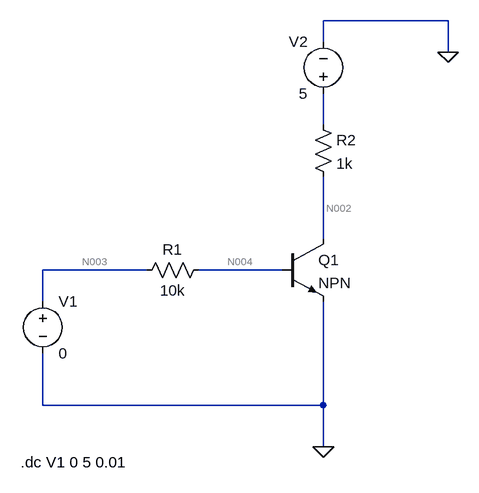
[diagram p0: schematic 1_Zadatak_Lab6.asc]
1_Zadatak_Lab6.asc, the LTspice schematic file:
Version 4
SHEET 1 880 680
WIRE 704 -304 512 -304
WIRE 512 -272 512 -304
WIRE 704 -256 704 -304
WIRE 512 -144 512 -192
WIRE 512 32 512 -64
WIRE 240 80 80 80
WIRE 448 80 320 80
WIRE 80 128 80 80
WIRE 80 288 80 208
WIRE 512 288 512 128
WIRE 512 288 80 288
WIRE 512 352 512 288
FLAG 704 -256 0
FLAG 512 352 0
SYMBOL voltage 80 112 R0
SYMATTR InstName V1
SYMATTR Value 0
SYMBOL res 336 64 R90
WINDOW 0 0 56 VBottom 2
WINDOW 3 32 56 VTop 2
SYMATTR InstName R1
SYMATTR Value 10k
SYMBOL npn 448 32 R0
SYMATTR InstName Q1
SYMBOL res 496 -160 R0
SYMATTR InstName R2
SYMATTR Value 1k
SYMBOL voltage 512 -176 R180
WINDOW 0 24 96 Left 2
WINDOW 3 24 16 Left 2
SYMATTR InstName V2
SYMATTR Value 5
TEXT 46 376 Left 2 !.dc V1 0 5 0.01

The netlist it stands for:
* 1_Zadatak_Lab6.asc
V1 N003 0 0
R1 N004 N003 10k
Q1 N002 N004 0 0 NPN
R2 N001 N002 1k
V2 N001 0 5
.model NPN NPN
.model PNP PNP
.lib standard.bjt
.dc V1 0 5 0.01
.backanno
.end

* Results of the author's LTspice run, read from the files saved beside the schematic
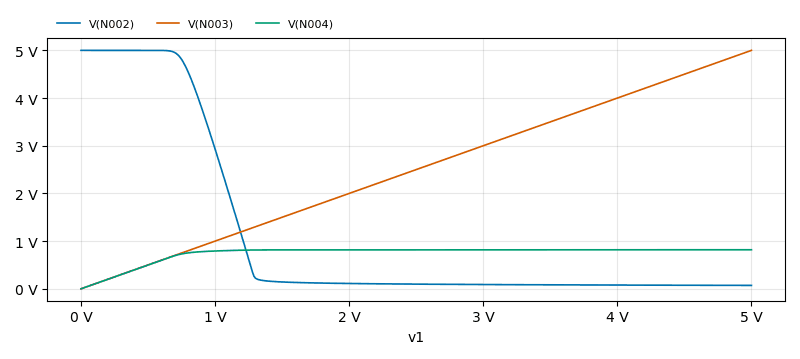
[diagram p1: DC transfer characteristic of 1_Zadatak_Lab6.asc, plotted from the saved traces]
* DC transfer characteristic, 1 run:
*   V(N002): 5 V at v1=0 V, 71.11 mV at v1=5 V, min 71.11 mV, max 5 V
*   V(N003): 0 V at v1=0 V, 5 V at v1=5 V, min 0 V, max 5 V
*   V(N004): 50 nV at v1=0 V, 819 mV at v1=5 V, min 50 nV, max 819 mV